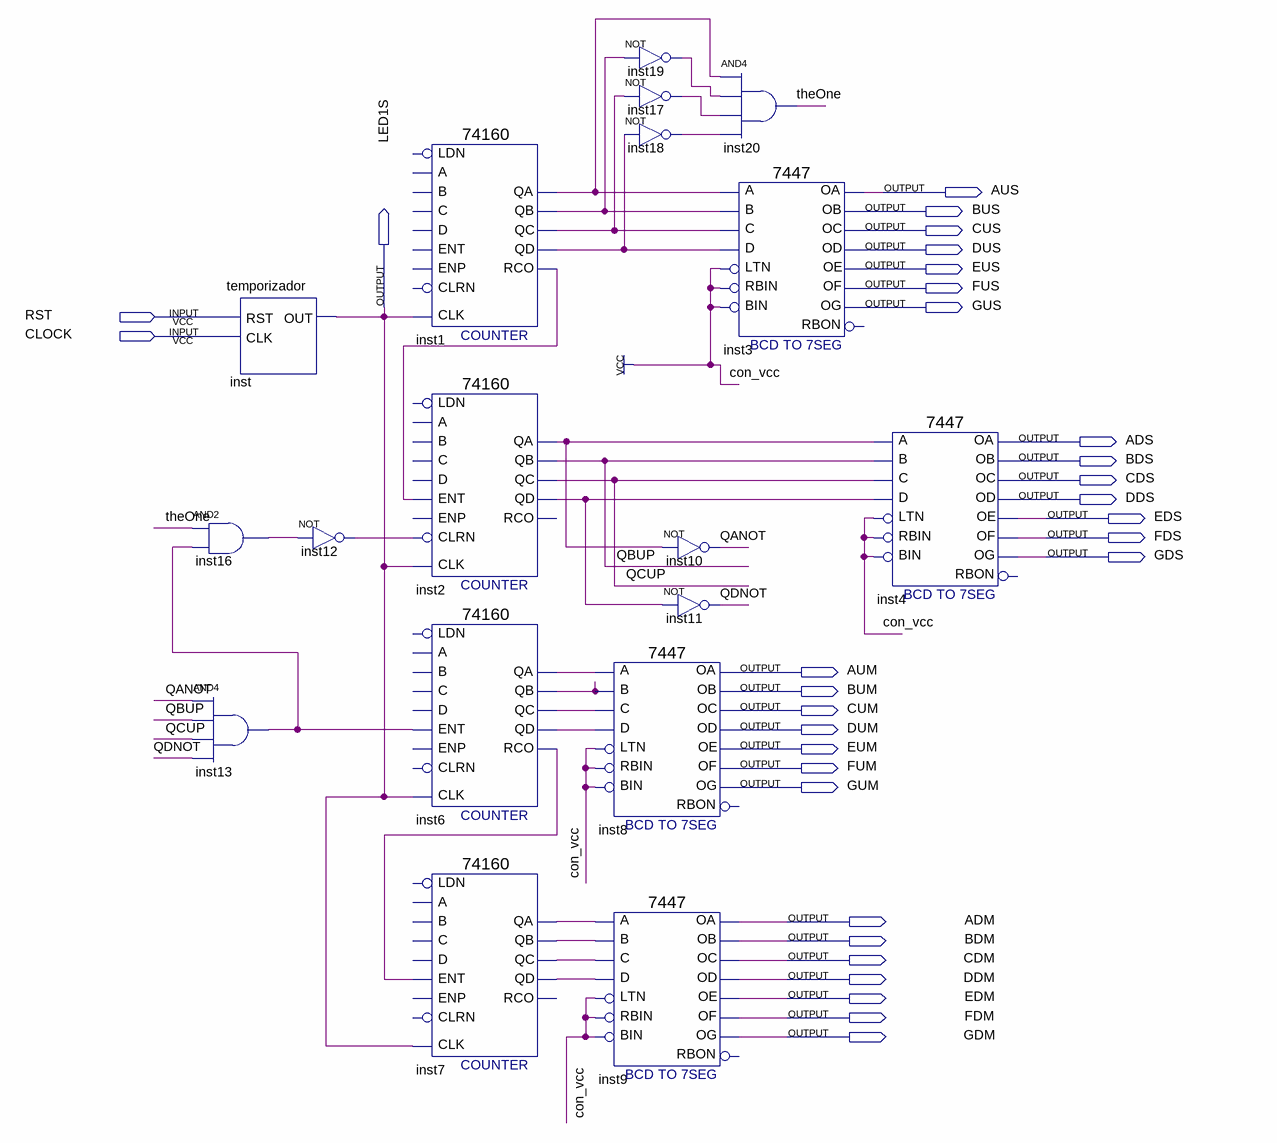
[diagram p0: schematic sheet]
// Quartus schematic contador_2.bdf as structural Verilog: 18 symbols, 31 pins
module contador_2 (
  input  RST,
  input  CLOCK,
  output AUS,
  output BUS,
  output CUS,
  output DUS,
  output EUS,
  output FUS,
  output LED1S,
  output GUS,
  output ADS,
  output BDS,
  output CDS,
  output DDS,
  output EDS,
  output FDS,
  output GDS,
  output AUM,
  output BUM,
  output CUM,
  output DUM,
  output EUM,
  output FUM,
  output GUM,
  output ADM,
  output BDM,
  output CDM,
  output DDM,
  output EDM,
  output FDM,
  output GDM
);

  wire inst1_qa, inst1_qb, inst1_qc, inst1_qd, inst1_rco, inst2_qa, inst2_qd, inst6_qa, inst6_qb, inst6_qc,
       inst6_qd, inst6_rco, inst7_qa, inst7_qb, inst7_qc, inst7_qd, inst12_out, inst13_out, inst16_out,
       inst17_out, inst18_out, inst19_out, QANOT, QBUP, QCUP, QDNOT, theOne;

  and inst16 (inst16_out, theOne, inst13_out);
  and inst13 (inst13_out, QANOT, QBUP, QCUP, QDNOT);
  temporizador inst (.RST(RST), .CLK(CLOCK), .OUT(LED1S));
  not inst12 (inst12_out, inst16_out);
  \74160  inst1 (
    .CLK(LED1S), .QD(inst1_qd), .QA(inst1_qa), .QB(inst1_qb), .QC(inst1_qc), .RCO(inst1_rco));  // open: ENT, A, B, C, D, LDN, ENP, CLRN
  \74160  inst2 (
    .CLK(LED1S), .ENT(inst1_rco), .CLRN(inst12_out), .QD(inst2_qd), .QA(inst2_qa), .QB(QBUP), .QC(QCUP));  // open: A, B, C, D, LDN, ENP, RCO
  \74160  inst6 (
    .CLK(LED1S), .ENT(inst13_out), .QD(inst6_qd), .QA(inst6_qa), .QB(inst6_qb), .QC(inst6_qc), .RCO(inst6_rco));  // open: A, B, C, D, LDN, ENP, CLRN
  \74160  inst7 (
    .CLK(LED1S), .ENT(inst6_rco), .QD(inst7_qd), .QA(inst7_qa), .QB(inst7_qb), .QC(inst7_qc));  // open: A, B, C, D, LDN, ENP, CLRN, RCO
  not inst19 (inst19_out, inst1_qb);
  not inst17 (inst17_out, inst1_qc);
  not inst18 (inst18_out, inst1_qd);
  not inst10 (QANOT, inst2_qa);
  not inst11 (QDNOT, inst2_qd);
  \7447  inst8 (
    .LTN(1'b1), .B(inst6_qb), .C(inst6_qc), .D(inst6_qd), .RBIN(1'b1), .BIN(1'b1), .A(inst6_qa), .OB(BUM),
    .OC(CUM), .OE(EUM), .OD(DUM), .OF(FUM), .OG(GUM), .OA(AUM));  // open: RBON
  \7447  inst9 (
    .LTN(1'b1), .B(inst7_qb), .C(inst7_qc), .D(inst7_qd), .RBIN(1'b1), .BIN(1'b1), .A(inst7_qa), .OB(BDM),
    .OC(CDM), .OE(EDM), .OD(DDM), .OF(FDM), .OG(GDM), .OA(ADM));  // open: RBON
  and inst20 (theOne, inst1_qa, inst19_out, inst17_out, inst18_out);
  \7447  inst3 (
    .LTN(1'b1), .B(inst1_qb), .C(inst1_qc), .D(inst1_qd), .RBIN(1'b1), .BIN(1'b1), .A(inst1_qa), .OB(BUS),
    .OC(CUS), .OE(EUS), .OD(DUS), .OF(FUS), .OG(GUS), .OA(AUS));  // open: RBON
  \7447  inst4 (
    .LTN(1'b1), .B(QBUP), .C(QCUP), .D(inst2_qd), .RBIN(1'b1), .BIN(1'b1), .A(inst2_qa), .OB(BDS), .OC(CDS),
    .OE(EDS), .OD(DDS), .OF(FDS), .OG(GDS), .OA(ADS));  // open: RBON
endmodule
